# Altium schematic sheet ReboostV2__Vsense.SchDoc: Voltage Sensor
size 420 x 297 mm; SheetNumber: 5
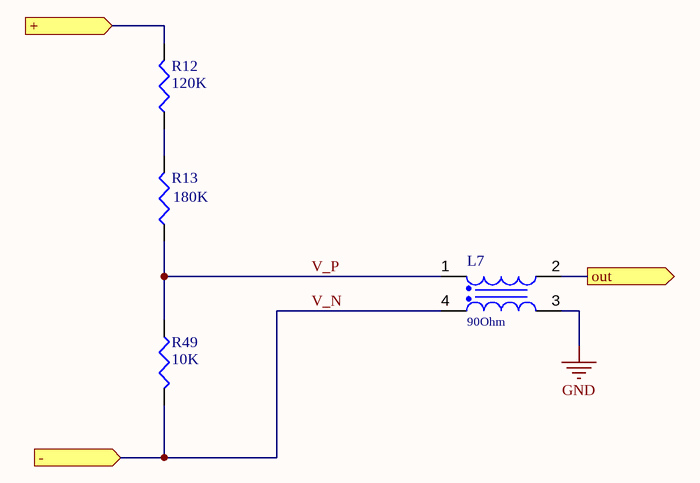
[diagram p0: ReboostV2__Vsense.SchDoc]

## Parts
L7  90Ohm  [WE-CNSW_0805]
R12  120K  [0603]
R13  180K  [0603]
R49  10K  [0603]

## Ports
+ (in), - (in), out (out)

## Nets
GND: L7.3
+: R12.2 ; port +
out: L7.2 ; port out
V_N: L7.4 R49.2 ; port -
V_P: L7.1 R13.1 R49.1
NetR12_1: R12.1 R13.2

## Notes on the sheet
- PROJECT
- www.tpee.nl <http://www.tpee.nl>
- TITLE
- FILE NAME
- A3
- SIZE
- Author:
- SHEET
- OF

## Library data of the parts
L7 = 744231091: WE-CNSW SMT Common Mode Line Filter, size 0805, 90Ohm, 0.37A, 50V; Manufacturer: Wurth Elektronik; DC Resistance max.: 0.3Ohm; Impedance Test Condition: 100MHz; Insulation Test Voltage: 125VAC; Winding Style: bifiliar; ComponentLink1Description: Manufacturer; ComponentLink1URL: http://www.we-online.de; ComponentLink2Description: Datasheet; ComponentLink2URL: https://www.we-online.com/catalog/datasheet/744231091.pdf; Operating Temperature: -40 to +125degC; Packaging: Tape and Reel; Published Date: April 2020; Rated Current: 0.37A; Size: 0805; Impedance: 90Ohm; Manufacturer Part Number: 744231091; Rated Voltage: 50V; Mounting Technology: SMT
R12 = 120K/0603/0063W/50V: Resistor, 120K, 1%, 0.063W, 50V, 100PPM, 0603; Brand: VISHAY DRALORIC; Brand Number: CRCW0603120KFKEA; Case Style: 0603; Order Code Supplier: 2122628; Power Rating: 0.063W; Price: 0,038; Resistance: 120K; Supplier: Farnell; Temperature Coefficient: ± 100PPM; Temperature Range: -55°C to +125°C; Voltage Rating: 50V; Manufacturer: VISHAY DRALORIC; Manufacturer Part Number: CRCW0603120KFKEA
R13 = 180K/0603/0063W/50V: Resistor, 180K, 1%, 0.063W, 50V, 100PPM, 0603; Brand: VISHAY DRALORIC; Brand Number: CRCW0603180KFKEA; Case Style: 0603; Order Code Supplier: 2122648; Power Rating: 0.063W; Price: 0,038; Resistance: 180K; Supplier: Farnell; Temperature Coefficient: ± 100PPM; Temperature Range: -55°C to +125°C; Voltage Rating: 50V; Manufacturer: VISHAY DRALORIC; Manufacturer Part Number: CRCW0603180KFKEA
R49 = 10K/0603/0063W/50V: Resistor, 10K, 1%, 0.063W, 50V, 100PPM, 0603; Brand: VISHAY DRALORIC; Brand Number: CRCW060310K0FKEA; Case Style: 0603; Order Code Supplier: 2122493; Power Rating: 0.063W; Price: 0,038; Resistance: 10K; Supplier: Farnell; Temperature Coefficient: ± 100PPM; Temperature Range: -55°C to +125°C; Voltage Rating: 50V; Manufacturer: VISHAY DRALORIC; Manufacturer Part Number: CRCW060310K0FKEA